# Altium schematic sheet sensor.SchDoc
size A4
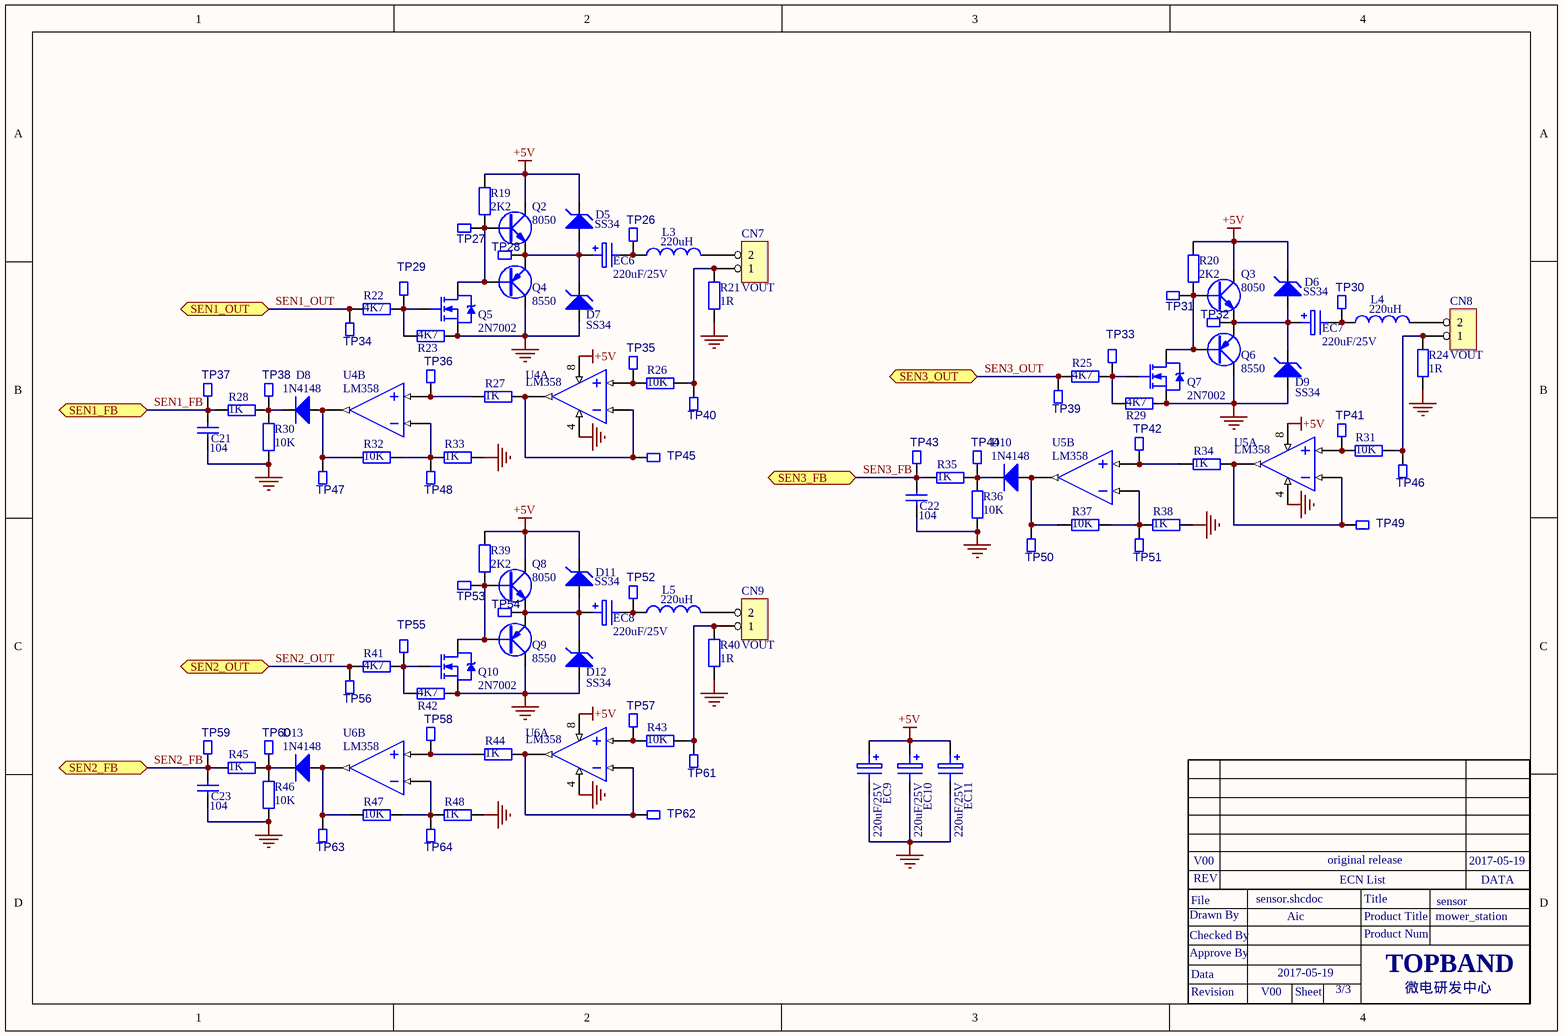
[diagram p0: sensor.SchDoc]

## Parts
C21  104  [0805C]
C22  104  [0805C]
C23  104  [0805C]
CN7  VOUT  [CON2-2.54]
CN8  VOUT  [CON2-2.54]
CN9  VOUT  [CON2-2.54]
D5  SS34  [SMA]
D6  SS34  [SMA]
D7  SS34  [SMA]
D8  1N4148  [SOD-123]
D9  SS34  [SMA]
D10  1N4148  [SOD-123]
D11  SS34  [SMA]
D12  SS34  [SMA]
D13  1N4148  [SOD-123]
EC6  220uF/25V  [EC10]
EC7  220uF/25V  [EC10]
EC8  220uF/25V  [EC10]
EC9  220uF/25V  [EC10]
EC10  220uF/25V  [EC10]
EC11  220uF/25V  [EC10]
L3  220uH  [150700618]
L4  220uH  [150700618]
L5  220uH  [150700618]
Q2  8050  [to-92]
Q3  8050  [to-92]
Q4  8550  [to-92]
Q5  2N7002  [SOT-23-GDS]
Q6  8550  [to-92]
Q7  2N7002  [SOT-23-GDS]
Q8  8050  [to-92]
Q9  8550  [to-92]
Q10  2N7002  [SOT-23-GDS]
R19  2K2  [0603R]
R20  2K2  [0603R]
R21  1R  [2512R]
R22  4K7  [0603R]
R23  4K7  [0603R]
R24  1R  [2512R]
R25  4K7  [0603R]
R26  10K  [0603R]
R27  1K  [0603R]
R28  1K  [0603R]
R29  4K7  [0603R]
R30  10K  [0603R]
R31  10K  [0603R]
R32  10K  [0603R]
R33  1K  [0603R]
R34  1K  [0603R]
R35  1K  [0603R]
R36  10K  [0603R]
R37  10K  [0603R]
R38  1K  [0603R]
R39  2K2  [0603R]
R40  1R  [2512R]
R41  4K7  [0603R]
R42  4K7  [0603R]
R43  10K  [0603R]
R44  1K  [0603R]
R45  1K  [0603R]
R46  10K  [0603R]
R47  10K  [0603R]
R48  1K  [0603R]
TP26  TP  [TEST-0.8MM]  (value not drawn)
TP27  TP  [TEST-0.8MM]  (value not drawn)
TP28  TP  [TEST-0.8MM]  (value not drawn)
TP29  TP  [TEST-0.8MM]  (value not drawn)
TP30  TP  [TEST-0.8MM]  (value not drawn)
TP31  TP  [TEST-0.8MM]  (value not drawn)
TP32  TP  [TEST-0.8MM]  (value not drawn)
TP33  TP  [TEST-0.8MM]  (value not drawn)
TP34  TP  [TEST-0.8MM]  (value not drawn)
TP35  TP  [TEST-0.8MM]  (value not drawn)
TP36  TP  [TEST-0.8MM]  (value not drawn)
TP37  TP  [TEST-0.8MM]  (value not drawn)
TP38  TP  [TEST-0.8MM]  (value not drawn)
TP39  TP  [TEST-0.8MM]  (value not drawn)
TP40  TP  [TEST-0.8MM]  (value not drawn)
TP41  TP  [TEST-0.8MM]  (value not drawn)
TP42  TP  [TEST-0.8MM]  (value not drawn)
TP43  TP  [TEST-0.8MM]  (value not drawn)
TP44  TP  [TEST-0.8MM]  (value not drawn)
TP45  TP  [TEST-0.8MM]  (value not drawn)
TP46  TP  [TEST-0.8MM]  (value not drawn)
TP47  TP  [TEST-0.8MM]  (value not drawn)
TP48  TP  [TEST-0.8MM]  (value not drawn)
TP49  TP  [TEST-0.8MM]  (value not drawn)
TP50  TP  [TEST-0.8MM]  (value not drawn)
TP51  TP  [TEST-0.8MM]  (value not drawn)
TP52  TP  [TEST-0.8MM]  (value not drawn)
TP53  TP  [TEST-0.8MM]  (value not drawn)
TP54  TP  [TEST-0.8MM]  (value not drawn)
TP55  TP  [TEST-0.8MM]  (value not drawn)
TP56  TP  [TEST-0.8MM]  (value not drawn)
TP57  TP  [TEST-0.8MM]  (value not drawn)
TP58  TP  [TEST-0.8MM]  (value not drawn)
TP59  TP  [TEST-0.8MM]  (value not drawn)
TP60  TP  [TEST-0.8MM]  (value not drawn)
TP61  TP  [TEST-0.8MM]  (value not drawn)
TP62  TP  [TEST-0.8MM]  (value not drawn)
TP63  TP  [TEST-0.8MM]  (value not drawn)
TP64  TP  [TEST-0.8MM]  (value not drawn)
U4  LM358  [SO-8]  (parts A,B of 2)
U5  LM358  [SO-8]  (parts A,B of 2)
U6  LM358  [SO-8]  (parts A,B of 2)

## Ports
SEN1_FB, SEN1_OUT, SEN2_FB, SEN2_OUT, SEN3_FB, SEN3_OUT

## Nets
+5V: D5.K D6.K D11.K EC9.1 EC10.1 EC11.1 Q2.C Q3.C Q8.C R19.2 R20.2 R39.2 U4.8(VCC) U5.8(VCC) U6.8(VCC)
GND: C21.1 C22.1 C23.1 D7.A D9.A D12.A EC9.2 EC10.2 EC11.2 Q4.C Q5.S Q6.C Q7.S Q9.C Q10.S R21.2 R23.1 R24.2 R29.1 R30.1 R33.2 R36.1 R38.2 R40.2 R42.1 R46.1 R48.2 U4.4(GND) U5.4(GND) U6.4(GND)
SEN1_FB: C21.2 R28.1 TP37.1 ; port SEN1_FB
SEN1_OUT: R22.2 TP34.1 ; port SEN1_OUT
SEN2_FB: C23.2 R45.1 TP59.1 ; port SEN2_FB
SEN2_OUT: R41.2 TP56.1 ; port SEN2_OUT
SEN3_FB: C22.2 R35.1 TP43.1 ; port SEN3_FB
SEN3_OUT: R25.2 TP39.1 ; port SEN3_OUT
NetCN7_1: CN7.1 R21.1 R26.2 TP40.1
NetCN7_2: CN7.2 L3.2
NetCN8_1: CN8.1 R24.1 R31.2 TP46.1
NetCN8_2: CN8.2 L4.2
NetCN9_1: CN9.1 R40.1 R43.2 TP61.1
NetCN9_2: CN9.2 L5.2
NetD5_A: D5.A D7.K EC6.1 Q2.E Q4.E TP28.1
NetD6_A: D6.A D9.K EC7.1 Q3.E Q6.E TP32.1
NetD8_A: D8.A R32.1 TP47.1 U4.1(OUT2)
NetD8_K: D8.K R28.2 R30.2 TP38.1
NetD10_A: D10.A R37.1 TP50.1 U5.1(OUT2)
NetD10_K: D10.K R35.2 R36.2 TP44.1
NetD11_A: D11.A D12.K EC8.1 Q8.E Q9.E TP54.1
NetD13_A: D13.A R47.1 TP63.1 U6.1(OUT2)
NetD13_K: D13.K R45.2 R46.2 TP60.1
NetEC6_2: EC6.2 L3.1 TP26.1
NetEC7_2: EC7.2 L4.1 TP30.1
NetEC8_2: EC8.2 L5.1 TP52.1
NetQ2_B: Q2.B Q4.B Q5.D R19.1 TP27.1
NetQ3_B: Q3.B Q6.B Q7.D R20.1 TP31.1
NetQ5_G: Q5.G R22.1 R23.2 TP29.1
NetQ7_G: Q7.G R25.1 R29.2 TP33.1
NetQ8_B: Q8.B Q9.B Q10.D R39.1 TP53.1
NetQ10_G: Q10.G R41.1 R42.2 TP55.1
NetR26_1: R26.1 TP35.1 U4.5(+IN1)
NetR27_1: R27.1 TP36.1 U4.3(IN2+)
NetR27_2: R27.2 TP45.1 U4.6(-IN1) U4.7(OUT1)
NetR31_1: R31.1 TP41.1 U5.5(+IN1)
NetR32_2: R32.2 R33.1 TP48.1 U4.2(-IN2)
NetR34_1: R34.1 TP42.1 U5.3(IN2+)
NetR34_2: R34.2 TP49.1 U5.6(-IN1) U5.7(OUT1)
NetR37_2: R37.2 R38.1 TP51.1 U5.2(-IN2)
NetR43_1: R43.1 TP57.1 U6.5(+IN1)
NetR44_1: R44.1 TP58.1 U6.3(IN2+)
NetR44_2: R44.2 TP62.1 U6.6(-IN1) U6.7(OUT1)
NetR47_2: R47.2 R48.1 TP64.1 U6.2(-IN2)

## Notes on the sheet
- Drawn By
- File
- REV
- V00
- sensor.shcdoc
- Aic
- original release
- ECN List
- Product Title
- Title
- mower_station
- sensor
- 2017-05-19
- DATA
- Approve By
- Checked By
- Data
- Product Num
- TOPBAND
- Revision
- Sheet
- 3/3
- 微电研发中心

## Library data of the parts
C21-C23 = Cap(0603): Component Kind: standard; Component Type: standard
CN7-CN9 = 2Pin(卧式): 插座; U_TABLE: U_SAM01021601; id: 20; Part Number: 2Pin(卧式); Component Kind: Standard; Component Type: Standard; Designator: 2Pin(卧式); Footprint: CON2-2.54卧式; Pin Count: 2
D5-D7 D9 D11 D12 = D Zener(贴片): 120301465; U_TABLE: U_SAM010203; id: 25; Description: 稳压二极管; Part Number: D Zener(贴片); Component Kind: standard; Component Type: standard; Pin Count: 2
D8 D10 D13 = Diode(DO-35)-D: 二极管; U_TABLE: U_SAM010203; id: 32; Part Number: Diode(DO-35)-D; Component Kind: standard; Component Type: standard; Pin Count: 2
EC6-EC11 = Electro(2.5mm): 电解电容; U_TABLE: U_SAM010202; id: 42; Part Number: Electro(2.5mm); Component Kind: standard; Component Type: standard; Pin Count: 2
L3-L5 = Inductor(0805): 150700618; U_TABLE: U_SAM010207; id: 140; Description: 电感; Part Number: Inductor(0805); Component Kind: standard; Component Type: standard
Q2 Q3 Q8 = NPN(贴片): 三极管; U_TABLE: U_SAM010204; id: 18; Part Number: NPN(贴片); Component Kind: standard; Component Type: standard; Pin Count: 3
Q4 Q6 Q9 = PNP(贴片): 三极管; U_TABLE: U_SAM010204; id: 20; Part Number: PNP(贴片); Component Kind: standard; Component Type: standard; Pin Count: 3
Q5 Q7 Q10 = NMOS-2: MOS管; U_TABLE: U_SAM010204; id: 17; Part Number: NMOS-2; Component Kind: standard; Component Type: standard; Pin Count: 3
R19-R25 R29 R39-R42 = Res2: Resistor; Value: 1K; 物料编码: 150103083; Published: 8-Jun-2000; LatestRevisionDate: 17-Jul-2002; LatestRevisionNote: Re-released for DXP Platform.; PackageReference: AXIAL-0.4; Publisher: Altium Limited
R26 R30-R32 R36 R37 R43 R46 R47 = Res2: Resistor; Value: 1K; Published: 8-Jun-2000; LatestRevisionDate: 17-Jul-2002; LatestRevisionNote: Re-released for DXP Platform.; PackageReference: AXIAL-0.4; Publisher: Altium Limited
R27 R28 R33-R35 R38 R44 R45 R48 = Res2: Resistor; Published: 8-Jun-2000; LatestRevisionDate: 17-Jul-2002; LatestRevisionNote: Re-released for DXP Platform.; PackageReference: AXIAL-0.4; Publisher: Altium Limited; Value: 1K
U4-U6 = IC_LM358: 121000225; U_TABLE: U_SAM010210; Description: 集成电路; id: 83; U_ITEM_ID（物料编码）: 121000100; U_100114（SAP物料描述）: SMT运放LM358_SO-8_TI_环保; U_100047（环保属性）: 环保; U_100107（工厂BOM使用频率）: 1000:1;1500:12;3000:7;5000:14;; U_100105（工厂库存）: 1000:7508.000;1500:160.000;2000:0.000;3000:485.000;5000:1542.000;; U_100117（工厂采购量）: 1000:7500.000;1500:300.000;3000:2500.000;5000:7500.000;; Part Number: IC_LM358; Component Kind: standard; Component Type: standard; Designator: IC_LM358; Footprint: DIP14; Pin Count: 8; U_100076（型号）: LM358; U_100040（封装方式）: SO-8; U_100086（指定供应商）: TI